# Altium schematic sheet Battery Protection.SchDoc
size A4; SheetNumber: 8; SheetTotal: 8
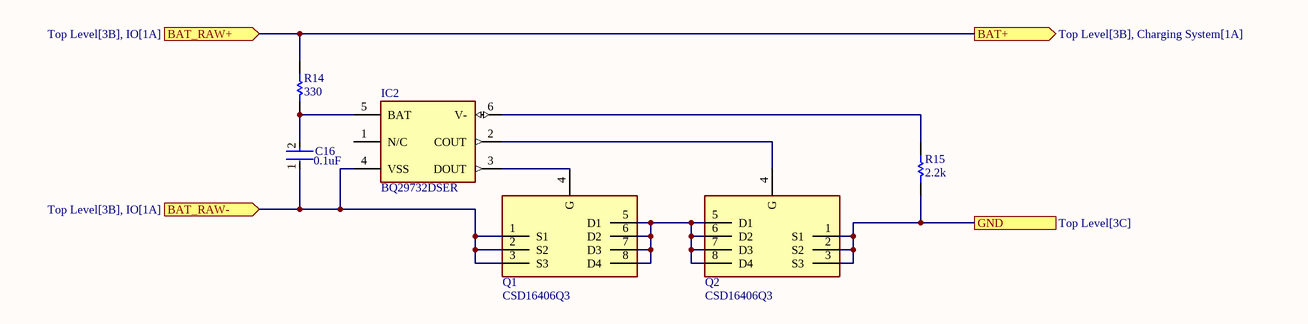
[diagram p0: Battery Protection.SchDoc]

## Parts
C16  Capacitance: 0.1uF  [FP-C1608-080-0_1-MFG]  (hidden comment: C1608X5R1A106K080AC)
IC2  BQ29732DSER  [SON50P150X150X80-6N]
Q1  CSD16406Q3  [DQG_VSON-CLIP]
Q2  CSD16406Q3  [DQG_VSON-CLIP]
R14  value 330  [0603]  (hidden comment: CRCW06032K10FKEAC)
R15  value 2.2k  [0603]  (hidden comment: CRCW06032K10FKEAC)

## Ports
BAT+ (out, see Top Level[3B], Charging System[1A]), BAT_RAW+ (in, see Top Level[3B], IO[1A]), BAT_RAW- (in, see Top Level[3B], IO[1A]), GND (see Top Level[3C])

## Nets
BAT+: R14.1 ; port BAT_RAW+, port BAT+
BAT_RAW-: C16.1 IC2.4(VSS) Q1.1(S1) Q1.2(S2) Q1.3(S3) ; port BAT_RAW-
GND: Q2.1(S1) Q2.2(S2) Q2.3(S3) R15.2 ; port GND
NetC16_2: C16.2 IC2.5(BAT) R14.2
NetIC2_2: IC2.2(COUT) Q2.4(G)
NetIC2_3: IC2.3(DOUT) Q1.4(G)
NetIC2_6: IC2.6(V-) R15.1
NetQ1_5: Q1.5(D1) Q1.6(D2) Q1.7(D3) Q1.8(D4) Q2.5(D1) Q2.6(D2) Q2.7(D3) Q2.8(D4)

Not connected (* = marked no-connect by the designer): IC2 1(N/C)

## Library data of the parts
C16 = CMP-2000-04979-3: Multilayer Ceramic Capacitors 10μF ±10% 10V X5R SMD 0603; Dielectric Material: Ceramic; Construction: Flat; Height: 0.8mm; Thickness: 0.035inch; Case Code (Metric): 1608; Radiation Hardening: No; Number of Pins: 2; Voltage Rating (DC): 10V; Depth: 0.8mm; Voltage: 10V; RoHS Compliant: Yes; Voltage Rating: 10V; Package Quantity: 1; Resistor Type: Ceramic; Termination: SMD/SMT; Lead Free: Lead Free; REACH SVHC: No SVHC; Tolerance: 10%; Mount: Surface Mount; Series: C; Packaging: Tape and Reel; Width: 0.8mm; Dielectric: X5R; Weight: 7.1E-05oz; Length: 1.6mm; Max Operating Temperature: 85°C; Case Code (Imperial): 0603; Case/Package: 0603; Min Operating Temperature: -55°C
IC2 = BQ29732DSER: Integrated Circuit; Manufacturer_Name: Texas Instruments; Datasheet Link: http://www.ti.com/lit/gpn/bq2973; Height: 0.8mm; Manufacturer_Part_Number: BQ29732DSER; Mouser Part Number: 595-BQ29732DSER; Mouser Price/Stock: https://www.mouser.co.uk/ProductDetail/Texas-Instruments/BQ29732DSER?qs=HjC056NR38EUdABiMgTGbg%3D%3D; Arrow Part Number: BQ29732DSER; Arrow Price/Stock: https://www.arrow.com/en/products/bq29732dser/texas-instruments?region=nac
Q1 Q2 = CSD16406Q3: MOSFET (N-Channel); Manufacturer_Name: Texas Instruments; Datasheet Link: http://www.ti.com/lit/gpn/csd16406q3; Manufacturer_Part_Number: CSD16406Q3; Mouser Part Number: 595-CSD16406Q3; Mouser Price/Stock: https://www.mouser.co.uk/ProductDetail/Texas-Instruments/CSD16406Q3?qs=SuDOdTVxq4Wogv4PDdDFZA%3D%3D; Arrow Part Number: CSD16406Q3; Arrow Price/Stock: https://www.arrow.com/en/products/csd16406q3/texas-instruments?region=nac
R14 R15 = CRCW06032K10FKEAC: Thick Film Resistors - SMD 1/10Watt 2.1Kohms 1%